# EasyEDA schematic schematic.json
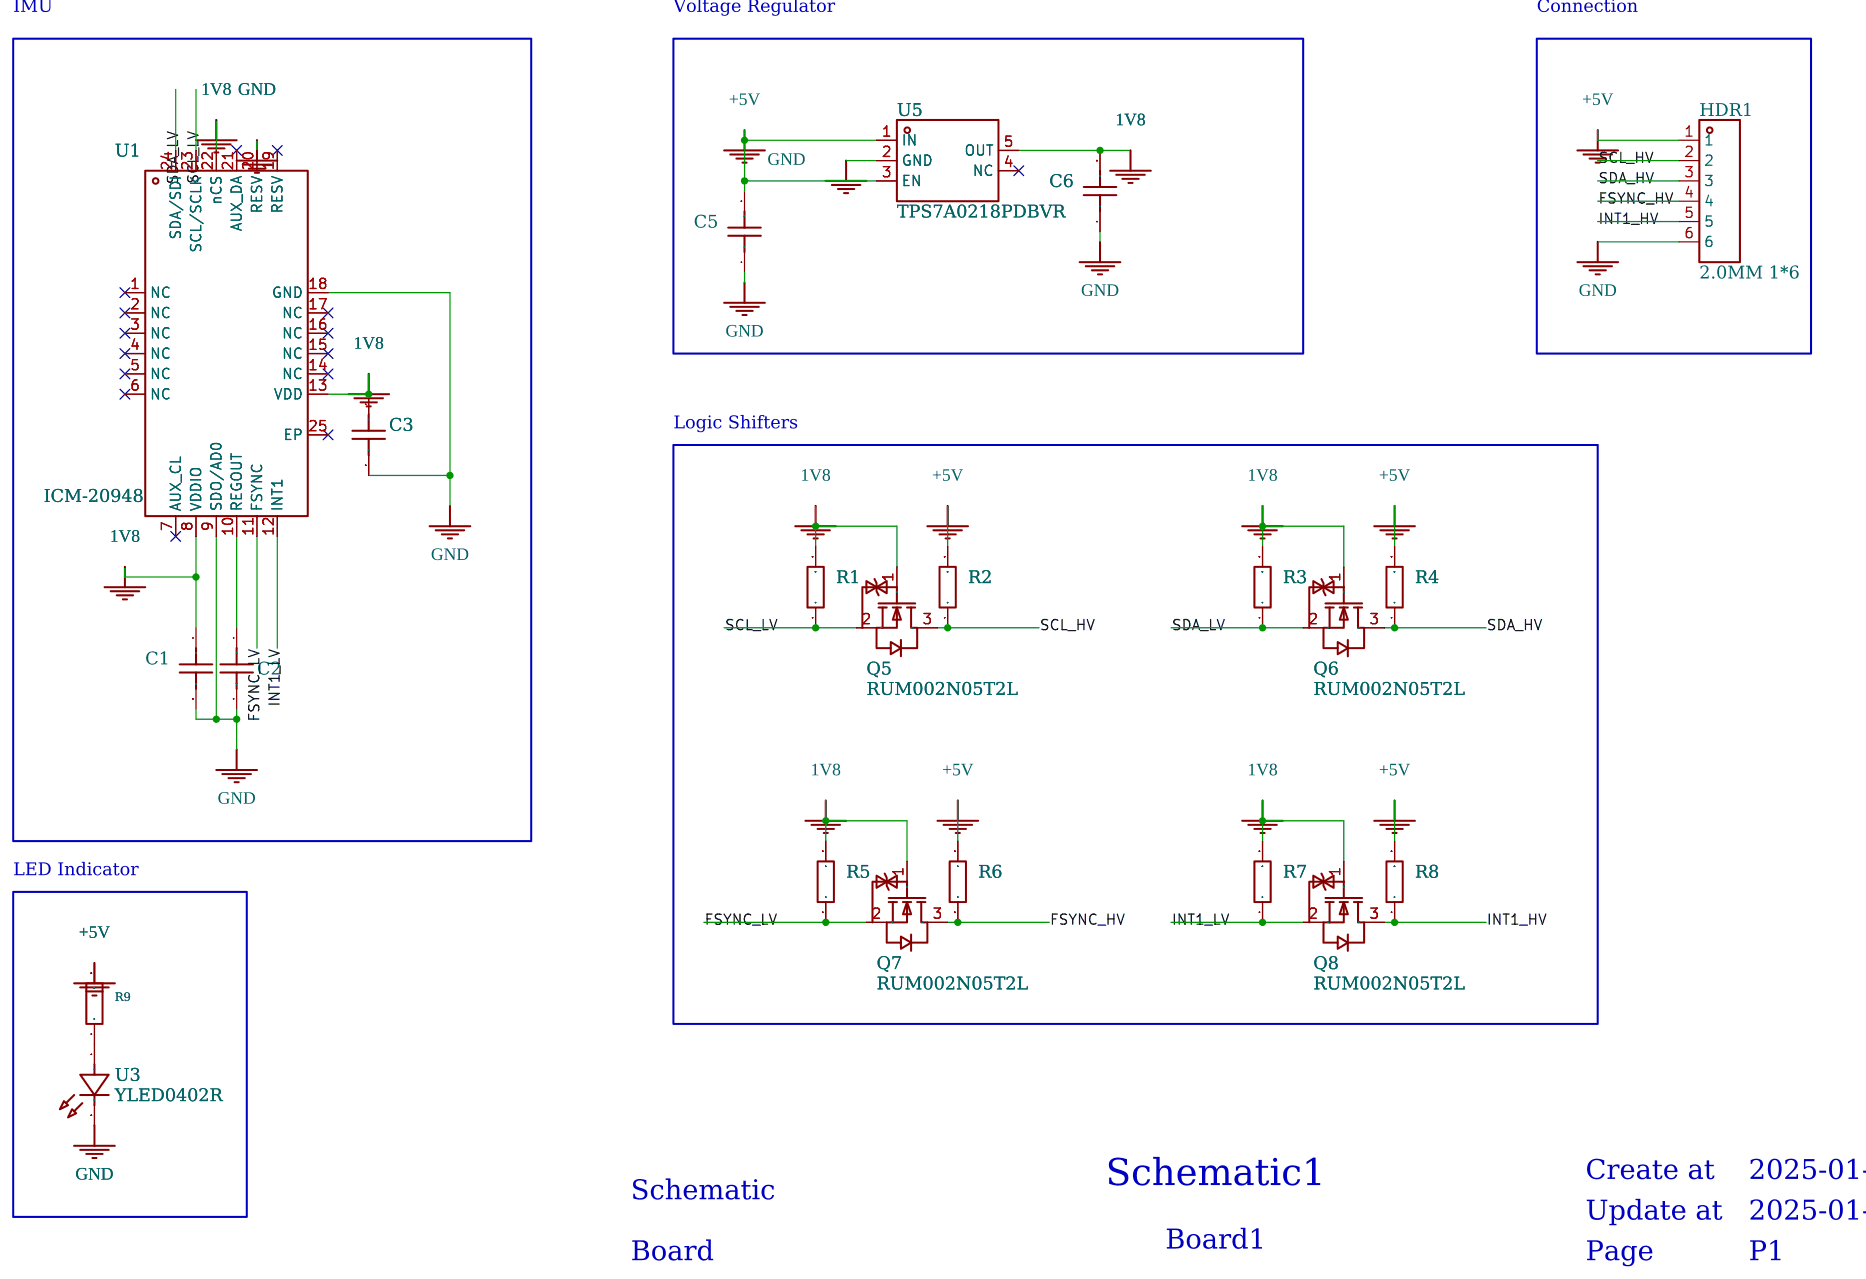
[diagram p0: schematic sheet]

## Parts
C1  100nF  [C0402]
C2  100nF  [C0402]
C3  100nF  [C0402]
C5  1uF  [C0402]
C6  1uF  [C0402]
HDR1  2.0MM 1*6  [HDR-TH_6P-P2.00-V-F]
Q5  RUM002N05T2L  [SOT-723-3_L1.2-W0.8-LS1.20-BR]
Q6  RUM002N05T2L  [SOT-723-3_L1.2-W0.8-LS1.20-BR]
Q7  RUM002N05T2L  [SOT-723-3_L1.2-W0.8-LS1.20-BR]
Q8  RUM002N05T2L  [SOT-723-3_L1.2-W0.8-LS1.20-BR]
R1  10K  [R0402]
R2  10K  [R0402]
R3  10K  [R0402]
R4  10K  [R0402]
R5  10K  [R0402]
R6  10K  [R0402]
R7  10K  [R0402]
R8  10K  [R0402]
R9  1kΩ  [R0402]
U1  ICM-20948  [QFN-24_L3.0-W3.0-P0.40-BL-EP]
U3  YLED0402R  [LED0402-R-RD]
U5  TPS7A0218PDBVR  [SOT-23-5_L2.9-W1.6-P0.95-LS2.8-BL]

## Library data of the parts
C1-C3 = -: Symbol: CL05B104KO5NNNC; Device: CL05B104KO5NNNC; LCSC Part Name: 100nF ±10% 16V; Supplier Part: C1525; Manufacturer: SAMSUNG(三星); Manufacturer Part: CL05B104KO5NNNC; Supplier Footprint: 0402; JLCPCB Part Class: Basic Part; Datasheet: https://atta.szlcsc.com/upload/public/pdf/source/20160218/1457707763339.pdf; Supplier: LCSC; Add into BOM: yes; Convert to PCB: yes; Tolerance: ±10%
C5 C6 = -: Symbol: CL05A105KA5NQNC; Device: CL05A105KA5NQNC; LCSC Part Name: 1uF ±10% 25V; Supplier Part: C52923; Manufacturer: SAMSUNG(三星); Manufacturer Part: CL05A105KA5NQNC; Supplier Footprint: 0402; JLCPCB Part Class: Basic Part; Datasheet: https://atta.szlcsc.com/upload/public/pdf/source/20160218/1457707763339.pdf; Supplier: LCSC; Add into BOM: yes; Convert to PCB: yes; Tolerance: ±10%
HDR1 = -: Supplier Part: C9900026821; Supplier Footprint: 排母1*6P; JLCPCB Part Class: Extended Part; Supplier: LCSC; Add into BOM: yes; Convert to PCB: yes
Q5-Q8 = -: LCSC Part Name: 1个N沟道 耐压:50V 电流:200mA; Supplier Part: C510347; Manufacturer: ROHM(罗姆); Supplier Footprint: SOT-723; JLCPCB Part Class: Extended Part; Datasheet: https://atta.szlcsc.com/upload/public/pdf/source/20200715/C510347_71EB77E13A2C4C21A05DC1C17F9C6EA5.pdf; Supplier: LCSC; Add into BOM: yes; Convert to PCB: yes; Type: 1 N-Channel; Drain Source Voltage (Vdss): 50V; Drain Source On Resistance (RDS(on)@Vgs,Id): 2.2Ω@4.5V,200mA; Gate Threshold Voltage (Vgs(th)@Id): 1V@1mA; Input Capacitance (Ciss@Vds): 25pF; Reverse Transfer Capacitance (Crss@Vds): 3pF@10V; Operating Temperature: -55℃+150℃
R1-R8 = -: Symbol: Res; Device: Res_0402; Convert to PCB: yes; Add into BOM: yes; Supplier Footprint: 0402
R9 = -: Symbol: 0402WGF1001TCE; Device: 0402WGF1001TCE; Supplier: LCSC; Manufacturer: UNI-ROYAL(厚声); Manufacturer Part: 0402WGF1001TCE; Supplier Part: C11702; JLCPCB Part Class: Basic Part; LCSC Part Name: 1kΩ ±1% 62.5mW 厚膜电阻; Supplier Footprint: 0402; Datasheet: https://atta.szlcsc.com/upload/public/pdf/source/20200306/C422600_1E6D84923E4A46A82E41ADD87F860B5C.pdf; Add into BOM: yes; Convert to PCB: yes; Type: Thick Film Resistors; Tolerance: ±1%; Temperature Coefficient: ±100ppm/℃; Operating Temperature Range: -55℃+155℃
U1 = -: Supplier Part: C726001; Manufacturer: TDK InvenSense(应美盛); Supplier Footprint: QFN-24(3x3); JLCPCB Part Class: Extended Part; Datasheet: https://atta.szlcsc.com/upload/public/pdf/source/20210715/C726001_EFE09342631EBC06FA98BEAE6CEEEE9D.pdf; Supplier: LCSC; Add into BOM: yes; Convert to PCB: yes; Sensor Type: Accelerometer gyroscope; Operating Temperature: -40℃+85℃
U3 = -: LCSC Part Name: 发光管; Supplier Part: C21260817; Manufacturer: YONGYUTAI(永裕泰); Supplier Footprint: 0402; JLCPCB Part Class: Extended Part; Datasheet: https://atta.szlcsc.com/upload/public/pdf/source/20240304/F5B78DC4846D6E27B24F174B920B2C01.pdf; Supplier: LCSC; Add into BOM: yes; Convert to PCB: yes
U5 = -: LCSC Part Name: 具有使能功能的 200mA、毫微功耗 IQ (25nA)、低压降 (LDO) 稳压器; Supplier Part: C3748843; Manufacturer: TI(德州仪器); Supplier Footprint: SOT-23-5; JLCPCB Part Class: Extended Part; Datasheet: https://www.ti.com/cn/lit/gpn/tps7a02; Supplier: LCSC; Add into BOM: yes; Convert to PCB: yes; Output Type: Fixed; Maximum Input Voltage: 6V; Output Voltage: 1.8V; Output Current: 200mA; Power Supply Rejection Ratio (PSRR): 55dB@(1kHz); Dropout Voltage: 450mV@(200mA); standby current: 60nA; Feature: Low ESR；Overcurrent Protection(OCP)；ESD Protection；Thermal Protection(TSD)；Under-voltage Lockout；With ability；Anti-Siphon; Operating Temperature: -40℃+125℃@(Tj); Output Polarity: Positive electrode; Number of Outputs: 1

## Nets
1V8: C1.1 C3.1 C6.2 Q5.1(G) Q6.1(G) Q7.1(G) Q8.1(G) R1.2 R3.2 R5.2 R7.2 U1.8(VDDIO) U1.13(VDD) U1.22(nCS) U5.5(OUT)
+5V: C5.2 HDR1.1 R2.2 R4.2 R6.2 R8.2 R9.2 U5.1(IN) U5.3(EN)
GND: C1.2 C2.2 C3.2 C5.1 C6.1 HDR1.6 U1.9(SDO/AD0) U1.18(GND) U1.20(RESV) U3.2(K) U5.2(GND)
FSYNC_HV: HDR1.4 Q7.3(D) R6.1
FSYNC_LV: Q7.2(S) R5.1 U1.11(FSYNC)
INT1_HV: HDR1.5 Q8.3(D) R8.1
INT1_LV: Q8.2(S) R7.1 U1.12(INT1)
SCL_HV: HDR1.2 Q5.3(D) R2.1
SCL_LV: Q5.2(S) R1.1 U1.23(SCL/SCLK)
SDA_HV: HDR1.3 Q6.3(D) R4.1
SDA_LV: Q6.2(S) R3.1 U1.24(SDA/SDI)
Net-(C2-1): C2.1 U1.10(REGOUT)
Net-(R9-1): R9.1 U3.1(A)

Not connected (* = marked no-connect by the designer): U1 1(NC)* 2(NC)* 3(NC)* 4(NC)* 5(NC)* 6(NC)* 7(AUX_CL)* 14(NC)* 15(NC)* 16(NC)* 17(NC)* 19(RESV)* 21(AUX_DA)* 25(EP)*; U5 4(NC)*

## Notes on the sheet
- 1
- 2
- 3
- 4
- 5
- 6
- IMU
- Voltage Regulator
- Connection
- A
- A
- Logic Shifters
- B
- B
- LED Indicator
- C
- C
- Schematic
- Schematic1
- Create at
- 2025-01-24
- Update at
- 2025-01-24
- Board1
- Board
- Page
- P1
- Drawn
- ICM20948 Breakout-2
- D
- Reviewed
- D
- Version
- Size
- Page  1  Total  1
- V1.0
- A4
- EasyEDA.com
- 1
- 2
- 3
- 4
- 5
- 6
